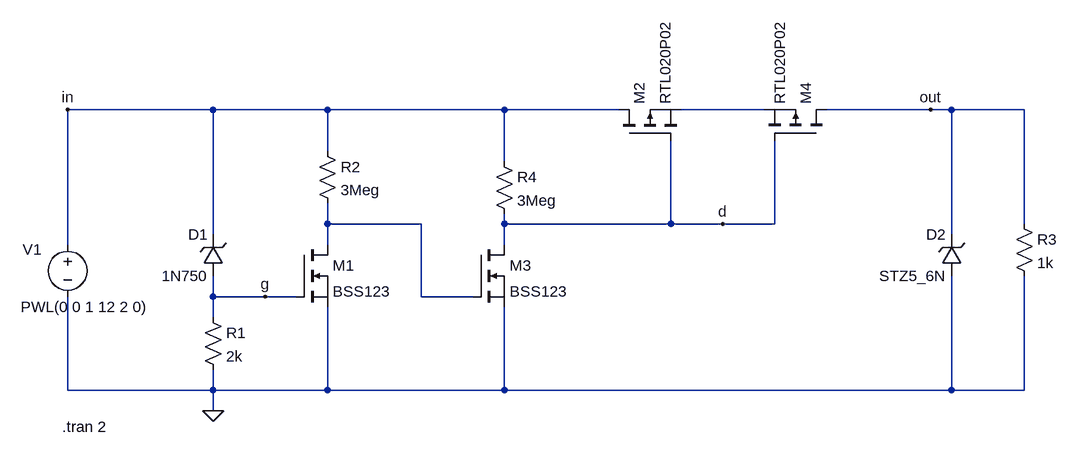
[diagram p0: schematic USB-C OV protection.asc]
USB-C OV protection.asc, the LTspice schematic file:
Version 4
SHEET 1 1668 680
WIRE 160 -80 -64 -80
WIRE 336 -80 160 -80
WIRE 608 -80 336 -80
WIRE 784 -80 608 -80
WIRE 1008 -80 880 -80
WIRE 1264 -80 1104 -80
WIRE 1296 -80 1264 -80
WIRE 1408 -80 1296 -80
WIRE 336 -16 336 -80
WIRE 608 0 608 -80
WIRE 336 96 336 64
WIRE 480 96 336 96
WIRE 608 96 608 80
WIRE 864 96 864 -32
WIRE 864 96 608 96
WIRE 944 96 864 96
WIRE 1024 96 1024 -32
WIRE 1024 96 944 96
WIRE 1408 96 1408 -80
WIRE 160 112 160 -80
WIRE 1296 112 1296 -80
WIRE -64 128 -64 -80
WIRE 336 128 336 96
WIRE 608 128 608 96
WIRE 160 208 160 176
WIRE 240 208 160 208
WIRE 288 208 240 208
WIRE 480 208 480 96
WIRE 560 208 480 208
WIRE 160 240 160 208
WIRE -64 352 -64 208
WIRE 160 352 160 320
WIRE 160 352 -64 352
WIRE 336 352 336 224
WIRE 336 352 160 352
WIRE 608 352 608 224
WIRE 608 352 336 352
WIRE 1296 352 1296 176
WIRE 1296 352 608 352
WIRE 1408 352 1408 176
WIRE 1408 352 1296 352
WIRE 160 384 160 352
FLAG 160 384 0
FLAG 1264 -80 out
FLAG -64 -80 in
FLAG 240 208 g
FLAG 944 96 d
SYMBOL zener 176 176 R180
WINDOW 0 24 64 Left 2
WINDOW 3 24 0 Left 2
SYMATTR InstName D1
SYMATTR Value 1N750
SYMATTR Description Diode
SYMATTR Type diode
SYMBOL res 144 224 R0
SYMATTR InstName R1
SYMATTR Value 2k
SYMBOL nmos 288 128 R0
SYMATTR InstName M1
SYMATTR Value BSS123
SYMBOL pmos 784 -32 R270
SYMATTR InstName M2
SYMATTR Value RTL020P02
SYMBOL res 320 -32 R0
SYMATTR InstName R2
SYMATTR Value 3Meg
SYMBOL voltage -64 112 R0
WINDOW 0 -69 23 Left 2
WINDOW 3 -72 112 Left 2
WINDOW 123 -236 162 Left 2
WINDOW 39 -236 134 Left 2
SYMATTR InstName V1
SYMATTR Value PWL(0 0 1 12 2 0)
SYMBOL nmos 560 128 R0
SYMATTR InstName M3
SYMATTR Value BSS123
SYMBOL res 592 -16 R0
SYMATTR InstName R4
SYMATTR Value 3Meg
SYMBOL pmos 1104 -32 M270
SYMATTR InstName M4
SYMATTR Value RTL020P02
SYMBOL res 1392 80 R0
SYMATTR InstName R3
SYMATTR Value 1k
SYMBOL zener 1312 176 R180
WINDOW 0 24 64 Left 2
WINDOW 3 24 0 Left 2
SYMATTR InstName D2
SYMATTR Value STZ5_6N
SYMATTR Description Diode
SYMATTR Type diode
TEXT -72 408 Left 2 !.tran 2

The netlist it stands for:
* USB-C OV protection.asc
D1 g in 1N750
R1 g 0 2k
M1 N002 g 0 0 BSS123
M2 in d N001 N001 RTL020P02
R2 in N002 3Meg
V1 in 0 PWL(0 0 1 12 2 0)
M3 d N002 0 0 BSS123
R4 in d 3Meg
M4 out d N001 N001 RTL020P02
R3 out 0 1k
D2 0 out STZ5_6N
.model D D
.lib standard.dio
.model NMOS NMOS
.model PMOS PMOS
.lib standard.mos
.tran 2
.backanno
.end